# EAGLE design motorBoard (EAGLE 7.4.0)
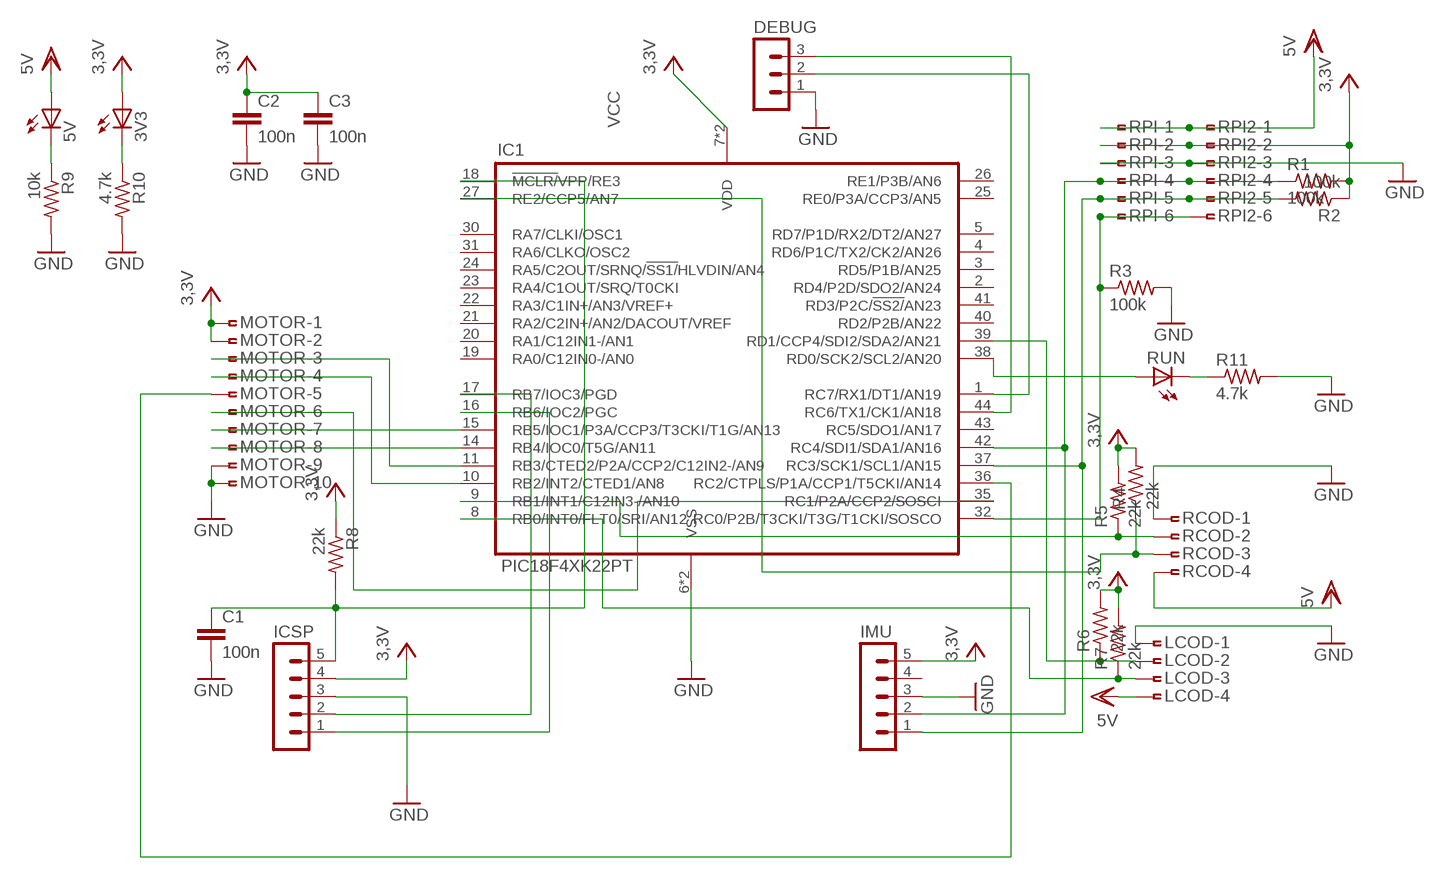
[diagram p0: schematic, sheet 1]

## Parts
3V3  LEDCHIPLED_0805  [CHIPLED_0805]
5V  LEDCHIPLED_0805  [CHIPLED_0805]
C1  100n  C-EUC0805  [C0805]
C2  100n  C-EUC0805  [C0805]
C3  100n  C-EUC0805  [C0805]
DEBUG  MA03-1  [MA03-1]
IC1  PIC18F4XK22PT  [TQFP44]
ICSP  MA05-1  [MA05-1]
IMU  MA05-1  [MA05-1]
LCOD  SMDTOP-4  [SMDTOP4]
MOTOR  SMDTOP-10  [SMDTOP10]
R1  100k  R-US_R0805  [R0805]
R2  100k  R-US_R0805  [R0805]
R3  100k  R-US_R0805  [R0805]
R4  22k  R-US_R0805  [R0805]
R5  22k  R-US_R0805  [R0805]
R6  22k  R-US_R0805  [R0805]
R7  22k  R-US_R0805  [R0805]
R8  22k  R-US_M0805  [M0805]
R9  10k  R-US_M0805  [M0805]
R10  4.7k  R-US_M0805  [M0805]
R11  4.7k  R-US_M0805  [M0805]
RCOD  SMDTOP-4  [SMDTOP4]
RPI  SMDTOP-6  [SMDTOP6]
RPI2  SMDTOP-6  [SMDTOP6]
RUN  LEDCHIPLED_0805  [CHIPLED_0805]

## Nets
GND: C1.2 C2.2 C3.2 DEBUG.1 IC1.6(VSS) IC1.29(VSS) ICSP.3 IMU.3 LCOD.1 MOTOR.9 MOTOR.10 R3.2 R9.2 R10.2 R11.2 RCOD.1 RPI2.3 RPI.3
N$1: IC1.27(RE2/CCP5/AN7) R4.1 RCOD.3
N$2: IC1.11(RB3/CTED2/P2A/CCP2/C12IN2-/AN9) MOTOR.3
N$3: IC1.10(RB2/INT2/CTED1/AN8) MOTOR.4
N$4: IC1.35(RC1/P2A/CCP2/SOSCI) MOTOR.6
N$5: IC1.16(RB6/IOC2/PGC) ICSP.1
N$6: IC1.14(RB4/IOC0/T5G/AN11) MOTOR.8
N$7: IC1.8(RB0/INT0/FLT0/SRI/AN12) LCOD.3 R7.1
N$8: IC1.15(RB5/IOC1/P3A/CCP3/T3CKI/T1G/AN13) MOTOR.7
N$9: R11.1 RUN.C
N$10: 5V.C R9.1
N$11: IC1.39(RD1/CCP4/SDI2/SDA2/AN21) LCOD.2 R6.1
N$12: DEBUG.2 IC1.1(RC7/RX1/DT1/AN19)
N$13: IC1.9(RB1/INT1/C12IN3-/AN10) R5.1 RCOD.2
N$14: 3V3.C R10.1
N$15: IC1.38(RD0/SCK2/SCL2/AN20) RUN.A
N$16: DEBUG.3 IC1.44(RC6/TX1/CK1/AN18)
N$17: IC1.17(RB7/IOC3/PGD) ICSP.2
N$18: C1.1 IC1.18(!MCLR/!VPP/RE3) ICSP.5 R8.2
N$19: IC1.42(RC4/SDI1/SDA1/AN16) IMU.2 R1.1 RPI2.4 RPI.4
N$20: IC1.37(RC3/SCK1/SCL1/AN15) IMU.1 R2.2 RPI2.5 RPI.5
N$21: IC1.32(RC0/P2B/T3CKI/T3G/T1CKI/SOSCO) R3.1 RPI2.6 RPI.6
N$23: IC1.36(RC2/CTPLS/P1A/CCP1/T5CKI/AN14) MOTOR.5
VCC: 3V3.A C2.1 C3.1 IC1.7(VDD) IC1.28(VDD) ICSP.4 IMU.5 MOTOR.1 MOTOR.2 R1.2 R2.1 R4.2 R5.2 R6.2 R7.2 R8.1 RPI2.2 RPI.2 ; supply symbol labelled 3,3V
VDD: 5V.A LCOD.4 RCOD.4 RPI2.1 RPI.1 ; supply symbol labelled 5V
Unconnected: IC1.2(RD4/P2D/SDO2/AN24) IC1.3(RD5/P1B/AN25) IC1.4(RD6/P1C/TX2/CK2/AN26) IC1.5(RD7/P1D/RX2/DT2/AN27) IC1.19(RA0/C12IN0-/AN0) IC1.20(RA1/C12IN1-/AN1) IC1.21(RA2/C2IN+/AN2/DACOUT/VREF) IC1.22(RA3/C1IN+/AN3/VREF+) IC1.23(RA4/C1OUT/SRQ/T0CKI) IC1.24(RA5/C2OUT/SRNQ/!SS1/!HLVDIN/AN4) IC1.25(RE0/P3A/CCP3/AN5) IC1.26(RE1/P3B/AN6) IC1.30(RA7/CLKI/OSC1) IC1.31(RA6/CLKO/OSC2) IC1.40(RD2/P2B/AN22) IC1.41(RD3/P2C/!SS2/!AN23) IC1.43(RC5/SDO1/AN17) IMU.4

## Library data of the parts
3V3 5V RUN = adafruit:LED: LED OSRAM: - CHIPLED LG R971, LG N971, LY N971, LG Q971, LY Q971, LO R971, LY R971 LH N974, LH R974 LS Q976, LO Q976, LY Q976 LO Q996 - Hyper CHIPLED LW Q18S LB Q993, LB Q99A, LB R99A - SideLED LS A670, LO A670, LY A670, LG A670, LP A670 LB A673, LV A673, LT A673, LW A673 LH A674 LY A675 LS A676, LA A676, LO A676, LY A676, LW A676 LS A679, LY A679, LG A679 - Hyper Micro SIDELED® LS Y876, LA Y876, LO Y876, LY Y876 LT Y87S - SmartLED LW L88C, LW L88S LB L89C, LB L89S, LG L890 LS L89K, LO L89K, LY L89K LS L896, LA L896, LO L896, LY L896 - TOPLED LS T670, LO T670, LY T670, LG T670, LP T670 LSG T670, LSP T670, LSY T670, LOP T670, LYG T670 LG T671, LOG T671, LSG T671 LB T673, LV T673, LT T673, LW T673 LH T674 LS T676, LA T676, LO T676, LY T676, LB T676, LH T676, LSB T676, LW T676 LB T67C, LV T67C, LT T67C, LS T67K, LO T67K, LY T67K, LW E67C LS E67B, LA E67B, LO E67B, LY E67B, LB E67C, LV E67C, LT E67C LW T67C LS T679, LY T679, LG T679 LS T770, LO T770, LY T770, LG T770, LP T770 LB T773, LV T773, LT T773, LW T773 LH T774 LS E675, LA E675, LY E675, LS T675 LS T776, LA T776, LO T776, LY T776, LB T776 LHGB T686 LT T68C, LB T68C - Hyper Mini TOPLED® LB M676 - Mini TOPLED Santana® LG M470 LS M47K, LO M47K, LY M47K Source: http://www.osram.convergy.de/
C1-C3 = resistor:C-EU: CAPACITOR, European symbol
DEBUG = con-lstb:MA03-1: PIN HEADER; OC_FARNELL: unknown; OC_NEWARK: unknown
IC1 = microchip-pic18f4xk22:PIC18F4XK22: The library has been designed by Richard Magdycz <https://www.facebook.com/groups/eaglecadsoftUK>
ICSP IMU = con-lstb:MA05-1: PIN HEADER; OC_FARNELL: unknown; OC_NEWARK: unknown
LCOD RCOD = con-amp:SMDTOP-4: AMP connector
MOTOR = con-amp:SMDTOP-10: AMP connector
R1-R11 = resistor:R-US_: RESISTOR, American symbol
RPI RPI2 = con-amp:SMDTOP-6: AMP connector

## Board
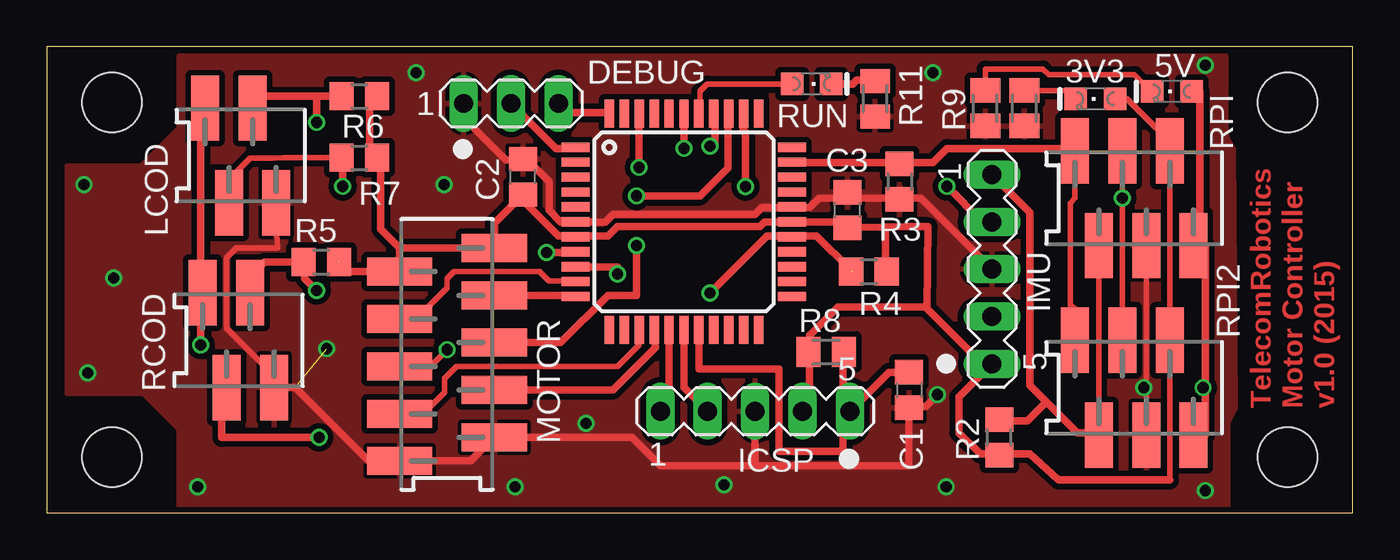
[diagram p1: board, top side]
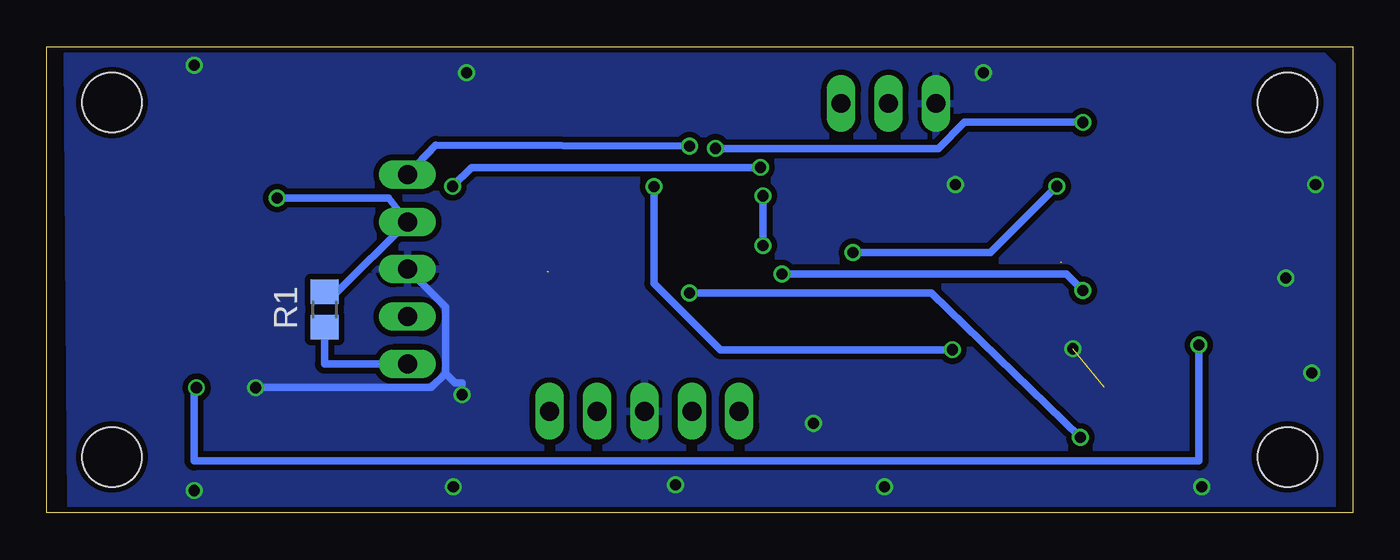
[diagram p2: board, bottom side, seen from below]

Size 70 x 25 mm. Coordinates in mm from the lower left corner, seen from the top.
Outline: 0,0 70,0 70,25 0,25 0,0
Copper layers (1*16): Top 0.018mm / dielectric 1.55mm / Bottom 0.018mm
Design rules "eC_2Layer_PClass6_BaseCopperO18_eCDefault *": minimum track width 0.15mm, minimum drill 0.35mm, track to track 0.15mm, track to pad 0.15mm, pad to pad 0.15mm, via to via 0.15mm, smd to smd 0mil, copper to edge 0.25mm, drill to drill 0.5mm, minimum pad ring 0.175mm, minimum via ring 0.125mm, stop-mask expansion 0mil, vias tented up to drill 0.45mm, thermal gap 0.2mm
Holes 3.2 mm at 3.5,3 66.5,3 3.5,22 66.5,22

### Footprints (pad centres in the part's own frame; a part is rotated, then mirrored left to right if it is on the bottom)
CHIPLED_0805 = smd 1.2 x 1.2: A 0,-1.05; C 0,1.05
C0805 = smd 1.3 x 1.5: 1 -0.95,0; 2 0.95,0
MA03-1 = drill 1.016 long: 1 -2.54,0; 2 0,0; 3 2.54,0
TQFP44 = smd 1.5 x 0.5: 1 -5.8,4; 2 -5.8,3.2; 3 -5.8,2.4; 4 -5.8,1.6; 5 -5.8,0.8; 6 -5.8,0; 7 -5.8,-0.8; 8 -5.8,-1.6; 9 -5.8,-2.4; 10 -5.8,-3.2; 11 -5.8,-4; 23 5.8,-4; 24 5.8,-3.2; 25 5.8,-2.4; 26 5.8,-1.6; 27 5.8,-0.8; 28 5.8,0; 29 5.8,0.8; 30 5.8,1.6; 31 5.8,2.4; 32 5.8,3.2; 33 5.8,4 | smd 0.5 x 1.5: 12 -4,-5.8; 13 -3.2,-5.8; 14 -2.4,-5.8; 15 -1.6,-5.8; 16 -0.8,-5.8; 17 0,-5.8; 18 0.8,-5.8; 19 1.6,-5.8; 20 2.4,-5.8; 21 3.2,-5.8; 22 4,-5.8; 34 4,5.8; 35 3.2,5.8; 36 2.4,5.8; 37 1.6,5.8; 38 0.8,5.8; 39 0,5.8; 40 -0.8,5.8; 41 -1.6,5.8; 42 -2.4,5.8; 43 -3.2,5.8; 44 -4,5.8
MA05-1 = drill 1.016 long: 1 -5.08,0; 2 -2.54,0; 3 0,0; 4 2.54,0; 5 5.08,0
SMDTOP4 = smd 1.5 x 3.5: 1 -1.905,2.54; 2 -0.635,-2.54; 3 0.635,2.54; 4 1.905,-2.54
SMDTOP10 = smd 1.5 x 3.5: 1 -5.715,2.54; 2 -4.445,-2.54; 3 -3.175,2.54; 4 -1.905,-2.54; 5 -0.635,2.54; 6 0.635,-2.54; 7 1.905,2.54; 8 3.175,-2.54; 9 4.445,2.54; 10 5.715,-2.54
R0805 = smd 1.3 x 1.5: 1 -0.95,0; 2 0.95,0
M0805 = smd 1.3 x 1.6: 1 -0.95,0; 2 0.95,0
SMDTOP6 = smd 1.5 x 3.5: 1 -3.175,2.54; 2 -1.905,-2.54; 3 -0.635,2.54; 4 0.635,-2.54; 5 1.905,2.54; 6 3.175,-2.54

### Placement (x,y rotation side)
3V3  56.2,22.2 90 top
5V  60.3,22.6 90 top
C1  46.22,6.59 270 top
C2  25.52,18.02 90 top
C3  42.92,16.24 90 top
DEBUG  24.88,21.95 0 top
IC1  34.16,15.61 0 top
ICSP  37.97,5.45 0 top
IMU  50.66,13.06 270 top
LCOD  10.41,19.16 180 top
MOTOR  21.45,8.49 270 top
R1  55.11,10.91 270 bottom
R2  51.05,4.05 90 top
R3  45.71,17.76 270 top
R4  44.06,12.94 0 top
R5  14.72,13.45 0 top
R6  16.76,22.34 0 top
R7  16.76,19.04 0 top
R8  41.77,8.62 0 top
R9  50.3,21.7 270 top
R10  52.4,21.7 270 top
R11  44.4,22.2 270 top
RCOD  10.28,9.26 180 top
RPI  58.28,16.88 180 top
RPI2  58.28,6.71 180 top
RUN  41,23 270 top

### Tracks (layer width: path | path; a pad name or v marks a point on that pad's centre or on a via)
GND  (via drill 0.6)  (1 unrouted)
  Top 0.305: RPI2.3 58.92,6.71 RPI.3 | 12.18,7.35 9.64,9.89 9.64,13.7 10.15,14.21 12.37,14.21 12.31,15.35
  Top 0.406: ICSP.3 37.97,2.52 | 37.97,2.52 46.22,2.52 C1.2 46.35,5.7 47.11,5.7 v47.74,6.33 | 42.79,16.88 45.71,16.88 R3.2 45.84,16.88 46.85,16.88 IMU.3 | 42.79,16.88 42.66,16.88 | 42.66,16.88 C3.2 42.79,16.88 | 42.66,16.88 41.39,16.88 40.89,16.37 40.12,16.37 IC1.29 39.87,16.37 38.35,16.37 37.97,15.99 30.34,15.99 29.96,15.61 IC1.6 27.55,15.61 26.92,16.24 26.92,17.76 25.77,18.91 25.65,18.91 C2.2 25.52,18.91 24.63,18.91 22.34,21.19 DEBUG.1 | 12.18,7.35 RCOD.1 13.33,6.71 17.26,2.78 MOTOR.10 22.73,2.78 MOTOR.9 31.36,4.05 32.88,2.52 37.97,2.52 | LCOD.1 12.31,15.35 | v58.79,6.71 58.92,6.71
  Bottom 0.406: IMU.3 48.63,11.03 48.63,7.48 | 48.63,7.48 49.4,6.71 v58.79,6.71 | 48.63,7.48 48.12,6.97 47.74,6.97 v47.74,6.33
  other vias: 3.6,12.6 36.3,1.5 21.3,17.6 28.9,4.8 2,17.6 2.2,7.5 8.1,1.4 62.1,24 62.1,1.2 19.8,23.6 47.5,23.6 25.1,1.4 48.2,1.4 15,8.8
  pour Bottom (isolate 0.305): 1.1,24 1.1,0.4 68.7,0.3 68.9,24.6 1.7,24.6
  pour Top (isolate 0.305): 63.2,24.5 7.1,24.5 7.1,20.6 5.1,18.6 1.1,18.6 1.1,6.4 5.2,6.4 7.1,4.5 7.1,0.3 63.3,0.3 63.3,4.8 63.7,5.6 63.6,19.5 63.2,20.3
N$1  (via drill 0.6)  (1 unrouted)
  Top 0.406: 43.17,12.94 43.17,13.06 43.05,13.06 41.27,14.84 40,14.84 IC1.27 39.87,14.84 38.6,14.84 v35.55,11.79 | RCOD.3 9.64,5.83 9.39,5.57 9.39,4.05 v14.6,4.05
  Bottom 0.406: v14.6,4.05 22.6,11.79 v35.55,11.79
N$2
  Top 0.406: MOTOR.3 28.29,11.67 IC1.11
N$3
  Top 0.305: 19.8,10.4 21.45,12.05 21.45,12.56 21.84,12.94 26.41,12.94 26.92,12.43 28.33,12.43
  Top 0.406: MOTOR.4 19.8,10.4 | 28.33,12.43 IC1.10
N$4  (via drill 0.6)
  Top 0.305: 20.57,7.86 v21.45,8.75
  Top 0.406: MOTOR.6 20.57,7.86 | v37.46,17.5 37.46,20.43 37.33,20.56 37.33,21.32 IC1.35
  Bottom 0.406: v21.45,8.75 33.9,8.75 37.46,12.3 v37.46,17.5
N$5
  Top 0.406: ICSP.1 33.35,5.92 IC1.16
N$6
  Top 0.305: 20.18,5.32 21.33,6.46 21.33,7.22 21.96,7.86 30.6,7.86 31.74,9 31.74,9.79
  Top 0.406: MOTOR.8 20.18,5.32 | 31.74,9.79 IC1.14
N$7  (via drill 0.6)
  Top 0.305: R7.1 12.69,19.04 12.18,19.03 10.91,19.03 9.77,17.89
  Top 0.406: LCOD.3 9.77,17.89 | v15.87,17.51 15.87,19.41 R7.1 | v26.79,13.95 28.31,13.95 IC1.8
  Bottom 0.406: v26.79,13.95 19.42,13.95 v15.87,17.51
N$8
  Top 0.406: MOTOR.7 30.34,6.59 32.63,8.87 32.5,9.76 IC1.15
N$9
  Top 0.406: RUN.C 43.2,23 43.4,23.2 44.4,23.2 R11.1
N$10
  Top 0.305: R9.1 50.3,23.8 53.4,23.8 53.7,23.5 58.3,23.5 59.2,22.6 5V.C
N$11  (via drill 0.6)
  Top 0.406: 14.47,22.34 11.17,22.34 11.04,22.21 LCOD.2 | 14.47,22.34 R6.1 | 14.47,22.34 v14.47,20.94 | IC1.39 v34.16,19.54
  Bottom 0.406: v14.47,20.94 20.82,20.94 22.22,19.54 v34.16,19.54
N$12
  Top 0.406: DEBUG.2 27.3,19.54 28.31,19.54 IC1.1
N$13  (via drill 0.6)
  Top 0.406: RCOD.2 10.91,12.68 11.68,13.45 R5.1 13.84,13.32 13.84,12.56 v14.47,11.92 | v30.6,12.81 30.6,13.19 28.44,13.19 IC1.9
  Bottom 0.406: v30.6,12.81 15.36,12.81 v14.47,11.92
N$14
  Top 0.305: R10.1 55,22.65 3V3.C
N$15
  Top 0.305: RUN.A 35.4,23 35,22.6 35,21.5 IC1.38
N$16
  Top 0.406: DEBUG.3 27.93,21.45 30.09,21.45 IC1.44
N$17
  Top 0.406: ICSP.2 34.16,6.71 IC1.17
N$18
  Top 0.406: C1.1 45.14,7.54 ICSP.5 42.92,5.57 42.92,6.71 42.66,6.97 | 42.66,6.97 42.66,8.62 R8.2 | 42.66,6.97 42.66,3.29 39.23,3.29 39.23,7.73 34.95,7.73 IC1.18
N$19  (via drill 0.6)
  Top 0.305: RPI2.4 v57.65,16.88 RPI.4
  Top 0.406: IMU.2 50.16,15.61 v48.25,17.51 | v31.74,18.53 31.74,21.32 IC1.42
  Bottom 0.406: v57.65,16.88 51.68,16.88 IMU.2 54.48,11.79 55.11,11.79 R1.1 | v48.25,17.51 47.24,18.53 v31.74,18.53
N$20  (via drill 0.6)
  Top 0.305: RPI2.5 RPI.5
  Top 0.406: 53.59,5.95 52.7,6.84 52.7,16.11 IMU.1 | 53.59,5.95 55.24,4.3 56.25,4.3 RPI2.5 | 53.59,5.95 52.57,4.94 51.05,4.94 R2.2 | v35.55,19.66 35.81,19.67 35.81,21.32 IC1.37
  Bottom 0.406: v35.55,19.66 49.15,19.71 IMU.1
N$21
  Top 0.305: RPI.6 55.11,16.88 54.86,16.62 54.86,11.16 55.11,10.91
  Top 0.406: 54.98,19.41 RPI.6 54.86,19.54 48.25,19.54 47.49,18.78 45.97,18.78 R3.1 45.71,18.78 40,18.78 IC1.32 | RPI2.6 55.11,10.91
N$23  (via drill 0.6)
  Top 0.406: MOTOR.5 27.55,9.13 30.09,11.67 31.61,11.67 v31.61,14.34 | 36.57,21.32 IC1.36 36.5,21 36.5,18.5 35,17 32,17 v31.61,17
  Bottom 0.406: v31.61,17 v31.61,14.34
VCC  (1 unrouted)
  Top 0.305: 60.19,1.76 RPI2.2 RPI.2 60.1,19.5 60.1,20 57.9,22.2 3V3.A
  Top 0.406: 60.19,1.76 54.22,1.76 52.7,3.16 51.05,3.16 R2.1 50.92,3.16 50.03,3.16 48.89,4.3 48.89,6.21 IMU.5 50.28,7.86 47.17,10.97 | 47.17,10.97 47.24,15.35 46.22,15.35 44.95,15.33 | 44.95,15.33 C3.1 43.05,15.61 IC1.28 38.47,15.61 38.22,15.35 30.6,15.35 30.09,14.84 28.44,14.84 IC1.7 28.19,14.84 27.42,14.84 25.27,17 25.39,17.13 25.52,17.13 C2.1 24,15.54 MOTOR.1 18.91,14.21 | ICSP.4 40.89,5.83 40.89,8.62 R8.1 40.89,8.75 40.89,9.51 42.41,11.03 47.11,11.03 47.17,10.97 | 18.91,14.21 MOTOR.2 15.74,12.94 15.61,13.06 15.61,13.45 | 17.3,19.67 17.3,22.34 R6.2 | 17.9,19.54 R7.2 17.64,19.41 17.3,19.67 | 17.3,19.67 17.9,19.54 | 17.9,19.54 17.9,15.22 18.91,14.21 | 44.95,15.33 44.95,15.22 44.95,12.94 R4.2
  Bottom 0.406: IMU.5 55.11,7.99 R1.2
VDD  (via drill 0.6)
  Top 0.305: 62.09,14.34 RPI.1
  Top 0.406: RPI2.1 62.09,4.17 62.09,6.71 | 62.09,6.71 62.09,14.34 | LCOD.4 8.5,21.07 8.25,20.81 8.25,12.81 RCOD.4 8.37,10.14 8.25,10.02 v8.25,9 | v61.97,6.71 62.09,6.71 | 5V.A 61.8,22.6 61.8,14.9
  Top 0.61: 61.8,14.9 61.46,14.9 RPI.1
  Bottom 0.406: v8.25,9 8.25,2.78 62.09,2.78 62.09,6.71 v61.97,6.71

### Text on the board
Top: TelecomRobotics | Motor Controller | v1.0 (2015)